# EAGLE design wcmain (EAGLE 9.2.2)
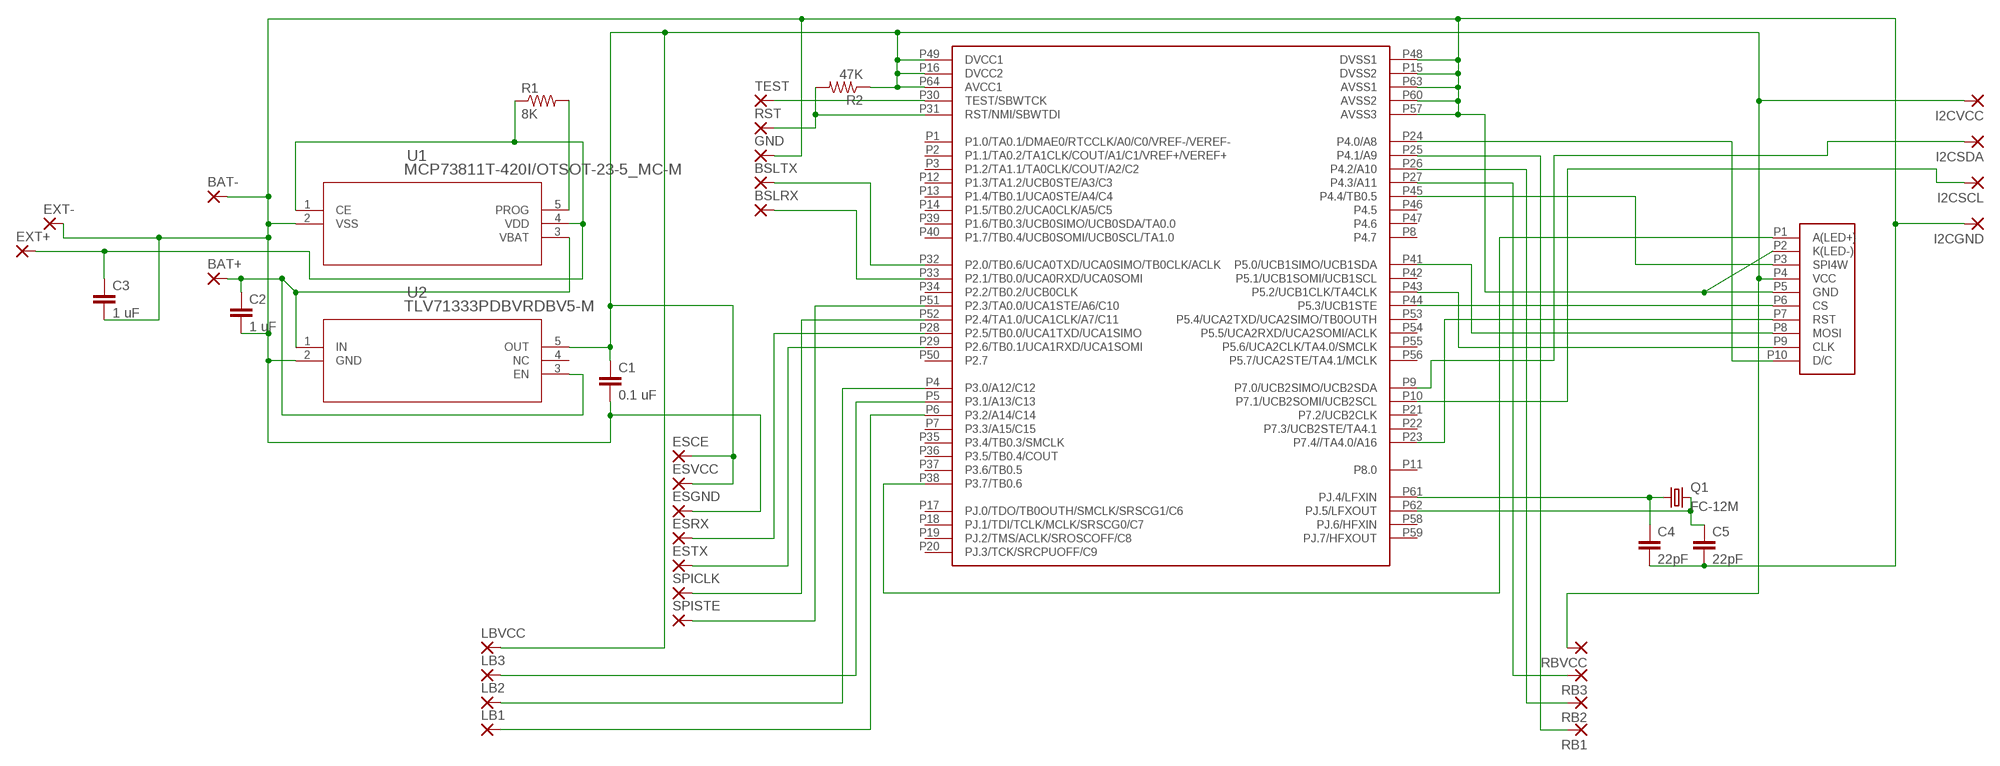
[diagram p0: schematic, sheet 1]

## Parts
BAT+  1,6/0,8  [1,6/0,8]
BAT-  1,6/0,8  [1,6/0,8]
BSLRX  1,6/0,8  [1,6/0,8]
BSLTX  1,6/0,8  [1,6/0,8]
C1  0.1 uF  C-EUC0805  [C0805]
C2  1 uF  C-EUC0805  [C0805]
C3  1 uF  C-EUC0805  [C0805]
C4  22pF  C-EUC0805  [C0805]
C5  22pF  C-EUC0805  [C0805]
ESCE  1,6/0,8  [1,6/0,8]
ESGND  1,6/0,8  [1,6/0,8]
ESRX  1,6/0,8  [1,6/0,8]
ESTX  1,6/0,8  [1,6/0,8]
ESVCC  1,6/0,8  [1,6/0,8]
EXT+  1,6/0,8  [1,6/0,8]
EXT-  1,6/0,8  [1,6/0,8]
GND  1,6/0,8  [1,6/0,8]
I2CGND  1,6/0,8  [1,6/0,8]
I2CSCL  1,6/0,8  [1,6/0,8]
I2CSDA  1,6/0,8  [1,6/0,8]
I2CVCC  1,6/0,8  [1,6/0,8]
LB1  1,6/0,8  [1,6/0,8]
LB2  1,6/0,8  [1,6/0,8]
LB3  1,6/0,8  [1,6/0,8]
LBVCC  1,6/0,8  [1,6/0,8]
Q1  FC-12M  [FC-12M]
R1  8K  R-US_R0402  [R0402]
R2  47K  R-US_R0402  [R0402]
RB1  1,6/0,8  [1,6/0,8]
RB2  1,6/0,8  [1,6/0,8]
RB3  1,6/0,8  [1,6/0,8]
RBVCC  1,6/0,8  [1,6/0,8]
RST  1,6/0,8  [1,6/0,8]
SPICLK  1,6/0,8  [1,6/0,8]
SPISTE  1,6/0,8  [1,6/0,8]
TEST  1,6/0,8  [1,6/0,8]
U1  MCP73811T-420I/OTSOT-23-5_MC-M  [SOT-23-5_MC-M]
U2  TLV71333PDBVRDBV5-M  [DBV5-M]
U$1  MSP430FR5994PM  [PM]
U$2  1-775333-0  [1-1775333-0]

## Nets
EXT+: C3.1 EXT+.1(P) R1.1 U1.1(CE) U1.4(VDD)
GND: BAT-.1(P) C1.2 C2.2 C3.2 C4.2 C5.2 ESGND.1(P) EXT-.1(P) GND.1(P) I2CGND.1(P) U1.2(VSS) U2.2(GND) U$1.P15(DVSS2) U$1.P48(DVSS1) U$1.P57(AVSS3) U$1.P60(AVSS2) U$1.P63(AVSS1) U$2.P2(K(LED-)) U$2.P5(GND)
N$1: SPICLK.1(P) U$1.P52(P2.4/TA1.0/UCA1CLK/A7/C11)
N$2: R2.2 RST.1(P) U$1.P31(RST/NMI/SBWTDI)
N$3: SPISTE.1(P) U$1.P51(P2.3/TA0.0/UCA1STE/A6/C10)
N$4: U$1.P41(P5.0/UCB1SIMO/UCB1SDA) U$2.P8(MOSI)
N$5: U$1.P43(P5.2/UCB1CLK/TA4CLK) U$2.P9(CLK)
N$6: U$1.P24(P4.0/A8) U$2.P10(D/C)
N$7: U$1.P23(P7.4//TA4.0/A16) U$2.P7(RST)
N$8: U$1.P44(P5.3/UCB1STE) U$2.P6(CS)
N$9: U$1.P38(P3.7/TB0.6) U$2.P1(A(LED+))
N$10: U$1.P45(P4.4/TB0.5) U$2.P3(SPI4W)
N$11: ESRX.1(P) U$1.P28(P2.5/TB0.0/UCA1TXD/UCA1SIMO)
N$12: TEST.1(P) U$1.P30(TEST/SBWTCK)
N$13: C4.1 Q1.1 U$1.P61(PJ.4/LFXIN)
N$14: R1.2 U1.5(PROG)
N$15: BSLTX.1(P) U$1.P32(P2.0/TB0.6/UCA0TXD/UCA0SIMO/TB0CLK/ACLK)
N$16: BSLRX.1(P) U$1.P33(P2.1/TB0.0/UCA0RXD/UCA0SOMI)
N$17: C5.1 Q1.2 U$1.P62(PJ.5/LFXOUT)
N$18: ESTX.1(P) U$1.P29(P2.6/TB0.1/UCA1RXD/UCA1SOMI)
N$19: LB2.1(P) U$1.P4(P3.0/A12/C12)
N$20: LB3.1(P) U$1.P5(P3.1/A13/C13)
N$21: LB1.1(P) U$1.P6(P3.2/A14/C14)
N$22: RB1.1(P) U$1.P25(P4.1/A9)
N$23: RB2.1(P) U$1.P26(P4.2/A10)
N$24: RB3.1(P) U$1.P27(P4.3/A11)
N$25: I2CSDA.1(P) U$1.P9(P7.0/UCB2SIMO/UCB2SDA)
N$26: I2CSCL.1(P) U$1.P10(P7.1/UCB2SOMI/UCB2SCL)
VBAT: BAT+.1(P) C2.1 U1.3(VBAT) U2.1(IN) U2.3(EN)
VCC: C1.1 ESCE.1(P) ESVCC.1(P) I2CVCC.1(P) LBVCC.1(P) R2.1 RBVCC.1(P) U2.5(OUT) U$1.P16(DVCC2) U$1.P49(DVCC1) U$1.P64(AVCC1) U$2.P4(VCC)
Unconnected: U2.4(NC) U$1.P1(P1.0/TA0.1/DMAE0/RTCCLK/A0/C0/VREF-/VEREF-) U$1.P2(P1.1/TA0.2/TA1CLK/COUT/A1/C1/VREF+/VEREF+) U$1.P3(P1.2/TA1.1/TA0CLK/COUT/A2/C2) U$1.P7(P3.3/A15/C15) U$1.P8(P4.7) U$1.P11(P8.0) U$1.P12(P1.3/TA1.2/UCB0STE/A3/C3) U$1.P13(P1.4/TB0.1/UCA0STE/A4/C4) U$1.P14(P1.5/TB0.2/UCA0CLK/A5/C5) U$1.P17(PJ.0/TDO/TB0OUTH/SMCLK/SRSCG1/C6) U$1.P18(PJ.1/TDI/TCLK/MCLK/SRSCG0/C7) U$1.P19(PJ.2/TMS/ACLK/SROSCOFF/C8) U$1.P20(PJ.3/TCK/SRCPUOFF/C9) U$1.P21(P7.2/UCB2CLK) U$1.P22(P7.3/UCB2STE/TA4.1) U$1.P34(P2.2/TB0.2/UCB0CLK) U$1.P35(P3.4/TB0.3/SMCLK) U$1.P36(P3.5/TB0.4/COUT) U$1.P37(P3.6/TB0.5) U$1.P39(P1.6/TB0.3/UCB0SIMO/UCB0SDA/TA0.0) U$1.P40(P1.7/TB0.4/UCB0SOMI/UCB0SCL/TA1.0) U$1.P42(P5.1/UCB1SOMI/UCB1SCL) U$1.P46(P4.5) U$1.P47(P4.6) U$1.P50(P2.7) U$1.P53(P5.4/UCA2TXD/UCA2SIMO/TB0OUTH) U$1.P54(P5.5/UCA2RXD/UCA2SOMI/ACLK) U$1.P55(P5.6/UCA2CLK/TA4.0/SMCLK) U$1.P56(P5.7/UCA2STE/TA4.1/MCLK) U$1.P58(PJ.6/HFXIN) U$1.P59(PJ.7/HFXOUT)

## Library data of the parts
BAT+ BAT- BSLRX BSLTX ESCE ESGND ESRX ESTX ESVCC EXT+ EXT- GND I2CGND I2CSCL I2CSDA I2CVCC LB1-LB3 LBVCC RB1-RB3 RBVCC RST SPICLK SPISTE TEST = wirepad:1,6/0,8: THROUGH-HOLE PAD
C1-C5 = rcl:C-EU: CAPACITOR, European symbol; SPICEPREFIX: C
Q1 = crystal:FC-12M: kHz RANGE CRYSTAL UNIT LOW PROFILE SMD Source: Epson Toyocom FC-12M.pdf
R1 R2 = resistor:R-US_: RESISTOR, American symbol
U1 = digikey:MCP73811T-420I/OT; MANUFACTURER_PART_NUMBER: MCP73811T420IOT; VENDOR: Microchip
U2 = digikey:TLV71333PDBVR; MANUFACTURER_PART_NUMBER: TLV71333PDBVR; VENDOR: TEXAS INSTRUMENTS
U$1 = MSP430:MSP430FR5994PM
U$2 = MSP430:1-775333-0

## Board
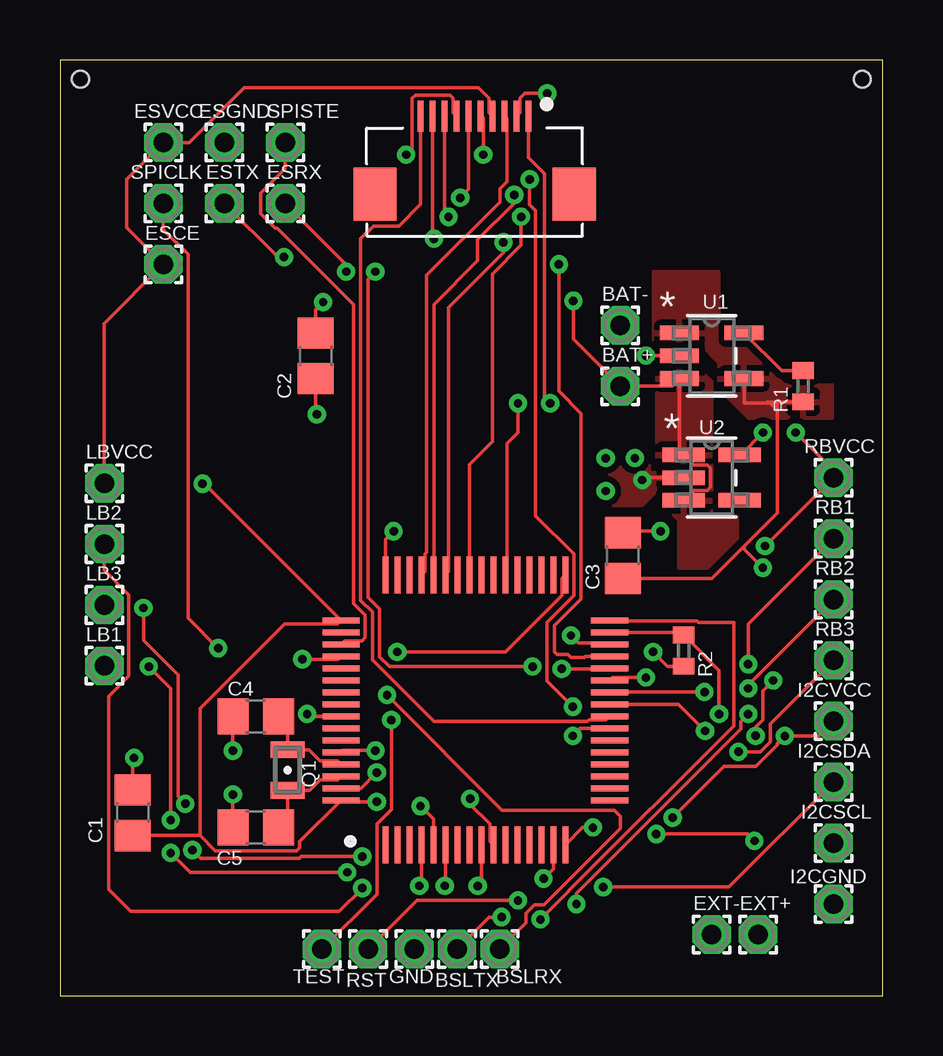
[diagram p1: board, top side]
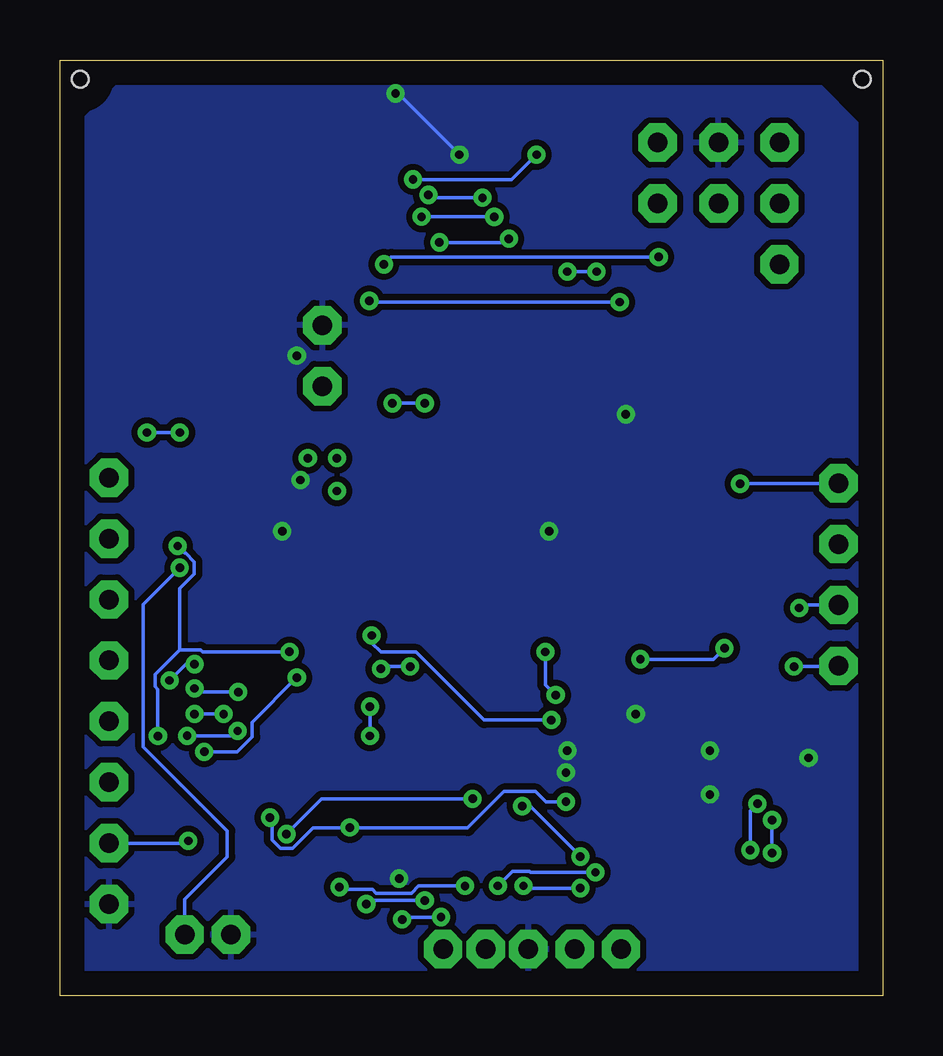
[diagram p2: board, bottom side, seen from below]

Size 34.3 x 39 mm. Coordinates in mm from the lower left corner, seen from the top.
Outline: 0,0 34.3,0 34.3,39 0,39 0,0
Copper layers (1*16): Top 0.035mm / dielectric 1.5mm / Bottom 0.035mm
Design rules "default *": minimum track width 6mil, minimum drill 0.35mm, track to track 6mil, track to pad 6mil, pad to pad 6mil, via to via 6mil, smd to smd 6mil, copper to edge 40mil, drill to drill 6mil, minimum pad ring 10mil, minimum via ring 8mil, stop-mask expansion 4mil, vias tented up to drill 0mil, thermal gap 10mil
Holes 0.7 mm at 0.85,38.2 33.45,38.2

### Footprints (pad centres in the part's own frame; a part is rotated, then mirrored left to right if it is on the bottom)
1,6/0,8 = drill 0.813 pad 1.6 octagon: 1 0,0
C0805 = smd 1.3 x 1.5: 1 -0.95,0; 2 0.95,0
FC-12M = smd 0.7 x 1.4: 1 -0.85,0; 2 0.85,0
R0402 = smd 0.7 x 0.9: 1 -0.65,0; 2 0.65,0
SOT-23-5_MC-M = smd 1.626 x 0.61: 1 -1.346,0.95; 2 -1.346,0; 3 -1.346,-0.95; 4 1.346,-0.95; 5 1.346,0.95
DBV5-M = smd 1.778 x 0.61: 1 -1.168,0.95; 2 -1.168,0; 3 -1.168,-0.95; 4 1.168,-0.95; 5 1.168,0.95
PM = smd 1.55 x 0.25: P1 -5.6,3.75; P2 -5.6,3.25; P3 -5.6,2.75; P4 -5.6,2.25; P5 -5.6,1.75; P6 -5.6,1.25; P7 -5.6,0.75; P8 -5.6,0.25; P9 -5.6,-0.25; P10 -5.6,-0.75; P11 -5.6,-1.25; P12 -5.6,-1.75; P13 -5.6,-2.25; P14 -5.6,-2.75; P15 -5.6,-3.25; P16 -5.6,-3.75; P33 5.65,-3.75; P34 5.65,-3.25; P35 5.65,-2.75; P36 5.65,-2.25; P37 5.65,-1.75; P38 5.65,-1.25; P39 5.65,-0.75; P40 5.65,-0.25; P41 5.65,0.25; P42 5.65,0.75; P43 5.65,1.25; P44 5.65,1.75; P45 5.65,2.25; P46 5.65,2.75; P47 5.65,3.25; P48 5.65,3.75 | smd 0.25 x 1.55: P17 -3.75,-5.6; P18 -3.25,-5.6; P19 -2.75,-5.6; P20 -2.25,-5.6; P21 -1.75,-5.6; P22 -1.25,-5.6; P23 -0.75,-5.6; P24 -0.25,-5.6; P25 0.25,-5.6; P26 0.75,-5.6; P27 1.25,-5.6; P28 1.75,-5.6; P29 2.25,-5.6; P30 2.75,-5.6; P31 3.25,-5.6; P32 3.75,-5.6; P49 3.75,5.6; P50 3.25,5.6; P51 2.75,5.6; P52 2.25,5.6; P53 1.75,5.6; P54 1.25,5.6; P55 0.75,5.6; P56 0.25,5.6; P57 -0.25,5.6; P58 -0.75,5.6; P59 -1.25,5.6; P60 -1.75,5.6; P61 -2.25,5.6; P62 -2.75,5.6; P63 -3.25,5.6; P64 -3.75,5.6
1-1775333-0 = smd 0.25 x 1.3: P1 2.25,0; P2 1.75,0; P3 1.25,0; P4 0.75,0; P5 0.25,0; P6 -0.25,0; P7 -0.75,0; P8 -1.25,0; P9 -1.75,0; P10 -2.25,0 | smd 1.8 x 2.2: P$11 -4.15,-3.25; P$12 4.15,-3.25

### Placement (x,y rotation side)
BAT+  23.36,25.4 0 top
BAT-  23.36,27.94 0 top
BSLRX  18.33,1.93 0 top
BSLTX  16.55,1.93 0 top
C1  3.04,7.62 90 top
C2  10.66,26.67 270 top
C3  23.46,18.34 90 top
C4  8.17,11.63 180 top
C5  8.17,7.01 180 top
ESCE  4.31,30.48 0 top
ESGND  6.85,35.56 0 top
ESRX  9.39,33.02 0 top
ESTX  6.85,33.02 0 top
ESVCC  4.31,35.56 0 top
EXT+  29.1,2.54 0 top
EXT-  27.17,2.54 0 top
GND  14.77,1.93 0 top
I2CGND  32.25,3.81 0 top
I2CSCL  32.25,6.35 0 top
I2CSDA  32.25,8.89 0 top
I2CVCC  32.25,11.43 0 top
LB1  1.85,13.74 0 top
LB2  1.85,18.82 0 top
LB3  1.85,16.28 0 top
LBVCC  1.85,21.36 0 top
Q1  9.49,9.4 270 top
R1  30.98,25.4 90 top
R2  26,14.38 90 top
RB1  32.25,19.05 0 top
RB2  32.25,16.51 0 top
RB3  32.25,13.97 0 top
RBVCC  32.25,21.59 0 top
RST  12.84,1.93 0 top
SPICLK  4.31,33.02 0 top
SPISTE  9.39,35.56 0 top
TEST  10.91,1.93 0 top
U1  27.17,26.67 0 top
U2  27.17,21.59 0 top
U$1  17.31,11.89 90 top
U$2  17.29,36.66 0 top

### Tracks (layer width: path | path; a pad name or v marks a point on that pad's centre or on a via)
EXT+  (via drill 0.35)
  Top 0.152: 29.49,24.75 29.91,24.75 | 29.91,24.75 R1.1 | C3.1 27.18,17.39 28.54,18.75 | 28.54,18.75 29.91,20.12 29.91,24.38 | 29.91,24.38 29.91,24.75 | v29.3,17.83 28.54,18.59 28.54,18.75 | U1.4 28.54,25.7 28.54,24.69 29.61,24.69 29.91,24.38
  Bottom 0.152: EXT+.1 29.1,4.01 27.32,5.79 27.32,6.86 30.83,10.36 30.83,16.31 v29.3,17.83
  pour Top (isolate 0.254): 24.88,27.13 26.71,27.13 27.47,26.37 27.47,25.3 28.69,24.08 32.2,24.08 32.2,25.45 30.22,25.45 28.69,26.97 27.63,26.97 27.47,27.13 27.47,30.18 24.73,30.18 24.73,27.28
GND  (via drill 0.35)
  Top 0.152: U$2.P5 arc-90 17.65,36.55 v17.65,35.05 | U$2.P2 19.19,36.81 19.19,37.41 19.39,37.61 v20.31,37.61 | C5.2 7.21,7.03 v7.21,8.38 | C1.2 3.04,9.86 v3.09,9.91 | U$1.P60 11.79,10.21 v13.15,10.21 | U$1.P63 12.55,8.64 v13.21,9.3 | U$1.P57 10.4,11.64 v10.3,11.73 | C2.2 10.66,24.28 v10.71,24.23 | U1.2 v24.43,26.67 | C3.2 23.53,19.36 v25.04,19.36 | U2.2 24.38,21.59 v24.27,21.49 | U$1.P15 20.57,5.28 v20.16,4.87 | v13.91,19.36 13.56,19.01 U$1.P48 | C4.2 7.21,11.62 v7.21,10.21
  Bottom 0.152: v17.65,35.05 20.2,37.61 v20.31,37.61
  pour Bottom (isolate 0.254): 3.4,38.71 0.35,35.66 0.35,0.15 33.88,0.15 33.88,35.97 31.13,38.71
  pour Top (isolate 0.254): 25.95,21.79 24.58,21.79 24.58,22.86 22.14,22.86 22.14,20.42 24.27,20.42 25.19,21.34 25.49,21.34
N$1  (via drill 0.35)
  Top 0.152: SPICLK.1 4.31,31.93 5.34,30.91 5.34,15.73 v6.6,14.48 | v10.1,14.02 11.6,14.02 U$1.P52
  Bottom 0.152: v6.6,14.48 7.05,14.02 v10.1,14.02
N$2  (via drill 0.35)
  Top 0.152: U$1.P31 25.89,15.14 R2.2 27.48,13.55 v27.48,11.73 | RST.1 14.88,3.96 v19.09,3.96 | v28.69,11.73 28.39,11.43 28.39,11.12 21.53,4.26 v21.53,3.81
  Bottom 0.152: v19.09,3.96 21.38,3.96 v21.53,3.81 | v27.48,11.73 v28.69,11.73
N$3
  Top 0.152: SPISTE.1 9.39,34.48 8.36,33.45 8.36,32.59 8.96,31.99 9.05,31.99 12.23,28.8 12.23,16.34 12.72,15.86 12.72,14.92 12.58,14.78 11.86,14.78 U$1.P51
N$4  (via drill 0.35)
  Top 0.152: U$2.P8 16.04,32.62 v16.2,32.46 | U$1.P41 17.07,22.13 18.03,23.09 18.03,30.08 19.23,31.28 v19.23,32.46
  Bottom 0.152: v16.2,32.46 v19.23,32.46
N$5  (via drill 0.35)
  Top 0.152: U$2.P9 15.54,31.44 15.59,31.39 v15.59,31.55 | U$1.P43 16.2,17.67 16.2,28.68 18.48,30.97 v18.48,31.39
  Bottom 0.152: v15.59,31.55 15.74,31.39 v18.48,31.39
N$6
  Top 0.152: U$2.P10 15.04,32.99 14.13,32.08 13.07,32.08 12.54,31.55 12.54,16.47 13.02,15.98 13.02,13.99 15.59,11.43 21.98,11.43 22.05,11.49 22.77,11.49 U$1.P24
N$7  (via drill 0.35)
  Top 0.152: U$2.P7 16.39,36.81 16.39,37.41 16.26,37.54 14.82,37.54 14.69,37.41 14.69,35.3 v14.43,35.05 | v19.58,34.02 19.58,32.96 19.83,32.71 19.83,19.99 21.42,18.41 21.42,16.67 20.31,15.56 20.31,13.11 v21.38,12.04 | v21.38,10.82 21.68,11.12 22.11,11.12 22.12,11.14 U$1.P23
  Bottom 0.152: v14.43,35.05 15.47,34.02 v19.58,34.02 | v21.38,12.04 v21.38,10.82
N$8  (via drill 0.35)
  Top 0.152: U$2.P6 17.04,33.61 v16.69,33.26 | U$1.P44 15.56,18.33 15.59,18.35 15.59,28.8 17.42,30.63 17.42,31.51 18.94,33.03 v18.94,33.38
  Bottom 0.152: v16.69,33.26 18.82,33.26 v18.94,33.38
N$9  (via drill 0.35)
  Top 0.152: U$2.P1 19.54,34.92 20.19,34.27 20.19,24.94 v20.44,24.69 | v19.09,24.69 19.09,23.47 18.64,23.01 18.64,17.61 U$1.P38
  Bottom 0.152: v20.44,24.69 v19.09,24.69
N$10
  Top 0.152: U$1.P45 15.21,17.68 15.21,18.41 15.28,18.48 15.28,30.02 18.33,33.07 18.33,33.63 18.64,33.93 18.64,36.56 U$2.P3
N$11  (via drill 0.35)
  Top 0.152: v19.7,13.72 13.73,13.72 13.33,14.12 13.33,16.11 12.84,16.59 12.84,29.87 v13.15,30.18 | v11.93,30.18 11.93,30.48 ESRX.1 | v20.92,13.62 22.9,13.62 U$1.P28
  Bottom 0.152: v20.92,13.62 arc90 20.82,13.72 v19.7,13.72 | v13.15,30.18 v11.93,30.18
N$12  (via drill 0.35)
  Top 0.152: TEST.1 13.21,4.23 13.21,7.16 13.81,7.76 v13.81,11.49 | U$1.P30 22.85,14.71 21.61,14.71 v21.3,15.01
  Bottom 0.152: v13.81,11.49 16.61,11.49 19.45,14.32 20.92,14.32 21.3,14.71 v21.3,15.01
N$13
  Top 0.152: C4.1 9.49,11.26 Q1.1 10.38,10.25 10.85,9.78 11.57,9.78 U$1.P61
N$14
  Top 0.152: U1.5 30.09,26.05 R1.2
N$15  (via drill 0.35)
  Top 0.152: BSLTX.1 17.89,3.27 v18.41,3.27 | U$1.P32 22.95,15.61 26.55,15.61 26.61,15.54 28.08,15.54 28.08,11.25 21.22,4.39 21.22,4.37 v20.03,3.17
  Bottom 0.152: v18.41,3.27 19.94,3.27 v20.03,3.17
N$16  (via drill 0.35)
  Top 0.152: v13.63,12.53 18.44,7.72 23.11,7.72 23.36,7.47 23.36,6.96 20.18,3.78 19.78,3.78 19.43,3.43 19.43,3.03 BSLRX.1 | U$1.P33 20.92,17.39 20.92,16.67 18.57,14.32 v14.06,14.32
  Bottom 0.152: v13.63,12.53 14.06,12.95 v14.06,14.32
N$17
  Top 0.152: C5.1 9.49,7.38 Q1.2 10.4,8.55 10.85,8.99 11.57,8.99 U$1.P62
N$18  (via drill 0.35)
  Top 0.152: v20.8,30.48 20.8,25.19 21.72,24.27 | 21.72,24.26 21.72,24.27 | v9.34,30.79 9.09,30.79 ESTX.1 | 21.72,24.27 21.72,18.54 21.72,18.53 21.72,16.54 20.62,15.44 20.62,14.33 20.72,14.23 21.17,14.23 21.3,14.1 21.86,14.1 21.9,14.14 U$1.P29
  Bottom 0.152: v20.8,30.48 20.49,30.79 v9.34,30.79
N$19  (via drill 0.35)
  Top 0.152: LB2.1 1.85,17.74 2.88,16.71 2.88,13.31 2.02,12.46 2.02,4.42 2.94,3.5 11.63,3.5 v12.6,4.48 | v14.98,4.57 15.06,4.66 U$1.P4
  Bottom 0.152: v12.6,4.48 14.88,4.48 v14.98,4.57
N$20  (via drill 0.35)
  Top 0.152: v12.6,5.79 10.06,5.79 9.99,5.73 5.86,5.73 v5.52,6.06 | v5.22,7.99 4.92,8.3 4.92,13.36 3.48,14.79 v3.48,16.15 | v15.03,7.9 15.56,7.36 U$1.P5
  Bottom 0.152: v5.52,6.06 5.52,7.69 v5.22,7.99 | v3.48,16.15 3.35,16.28 LB3.1 | v15.03,7.9 14.71,7.9 v12.6,5.79
N$21  (via drill 0.35)
  Top 0.152: v3.7,13.72 4.62,12.8 v4.62,7.32 | v4.62,5.94 5.42,5.14 v11.98,5.14 | v16.05,4.57 16.06,4.59 U$1.P6
  Bottom 0.152: LB1.1 1.87,13.72 v3.7,13.72 | v4.62,7.32 v4.62,5.94 | v11.98,5.14 14.68,5.14 14.73,5.18 15.44,5.18 v16.05,4.57
N$22  (via drill 0.35)
  Top 0.152: U$1.P25 25.79,12.14 v26.89,11.03 | v29,10.83 29,11.18 29.3,11.48 29.3,12.7 v29.73,13.13 | v28.69,13.81 28.69,15.49 RB1.1
  Bottom 0.152: v26.89,11.03 27.1,10.83 v29,10.83 | v29.73,13.13 29.06,13.81 v28.69,13.81
N$23  (via drill 0.35)
  Top 0.152: RB2.1 28.69,12.95 v28.69,12.8 | v26.87,12.65 22.93,12.65 U$1.P26
  Bottom 0.152: v28.69,12.8 28.54,12.65 v26.87,12.65
N$24  (via drill 0.35)
  Top 0.152: RB3.1 29.61,11.33 29.61,10.57 29.19,10.16 v28.29,10.16 | v24.43,13.26 23.03,13.26 U$1.P27
  Bottom 0.152: v24.43,13.26 26.29,11.39 26.29,10.78 26.91,10.16 v28.29,10.16
N$25  (via drill 0.35)
  Top 0.152: I2CSDA.1 27.88,4.52 v22.65,4.52 | v17.42,4.57 17.57,4.72 U$1.P9
  Bottom 0.152: v17.42,4.57 19.34,4.57 19.65,4.27 21.13,4.27 21.28,4.42 22.55,4.42 v22.65,4.52
N$26  (via drill 0.35)
  Top 0.152: U$1.P10 17.92,6.43 17.92,7.16 17.1,7.98 v17.1,8.2 | v24.86,6.73 28.67,6.73 v28.95,6.45
  Bottom 0.152: v28.95,6.45 29.05,6.35 I2CSCL.1 | v17.1,8.2 23.39,8.2 v24.86,6.73
N$27  (via drill 0.35)
  other vias: 23.97,22.4
N$28  (via drill 0.35)
  other vias: 22.75,22.4
N$29  (via drill 0.35)
  other vias: 22.75,21.03
VBAT  (via drill 0.35)
  Top 0.152: v21.4,28.96 21.4,27.36 BAT+.1 25.5,25.4 U1.3 25.82,22.72 U2.1 26.42,22.12 26.98,22.12 27.12,21.99 27.12,21.19 26.98,21.06 26.42,21.06 U2.3 | v10.97,28.91 10.66,28.6 C2.1
  Bottom 0.152: v10.97,28.91 21.36,28.91 v21.4,28.96
  pour Top (isolate 0.254): 24.88,22.1 27.17,22.1 27.17,25.6 26.71,26.06 24.88,26.06
  pour Top (isolate 0.254): 25.19,20.42 25.8,19.81 25.8,17.83 27.02,17.83 28.24,19.05 28.24,19.96 27.17,19.96 27.17,23.32 26.87,23.32 26.87,22.25 27.02,21.79 27.02,21.18 26.26,20.42
VCC  (via drill 0.35)
  Top 0.152: I2CVCC.1 31.64,10.82 v30.22,10.82 29.91,10.51 29.91,10.45 29.02,9.55 27.68,9.55 v25.54,7.42 | v24.73,14.33 25.33,13.73 R2.1 | LBVCC.1 1.85,28.02 ESCE.1 2.79,32 2.79,34.04 ESVCC.1 5.39,35.56 7.68,37.84 17.45,37.84 17.89,37.41 17.89,36.81 U$2.P4 | C1.1 5.84,6.67 | 5.84,6.67 6.48,6.03 9.87,6.03 10,6.17 10,6.42 U$1.P64 11.78,8.08 v13.21,8.08 | v5.95,21.34 6.02,21.34 U$1.P49 11.57,15.49 9.36,15.49 5.84,11.97 5.84,6.67 | 28.68,22.54 U2.5 28.38,22.54 v29.31,23.47 | v29.39,18.74 v29.4,18.74 RBVCC.1 32.25,21.89 v30.67,23.47 | v22.22,7.01 21.78,7.01 U$1.P16
  Bottom 0.152: v30.22,10.82 30.22,12.76 30.34,12.88 30.34,13.39 29.31,14.42 | 29.31,14.42 28.44,14.42 28.35,14.33 v24.73,14.33 | v5.95,21.34 1.87,21.34 LBVCC.1 | v25.54,7.42 25.46,7.34 25.46,6.48 25.11,6.12 24.61,6.12 23.75,6.99 22.24,6.99 v22.22,7.01 22.2,6.99 17.3,6.99 15.79,8.5 14.47,8.5 14.05,8.08 v13.21,8.08 | v29.31,23.47 v30.67,23.47 | v29.39,18.74 29.09,18.44 29.05,18.44 28.7,18.08 28.7,17.58 29.31,16.97 29.31,14.42